# Altium schematic sheet PBC.SchDoc: =filename
size A4
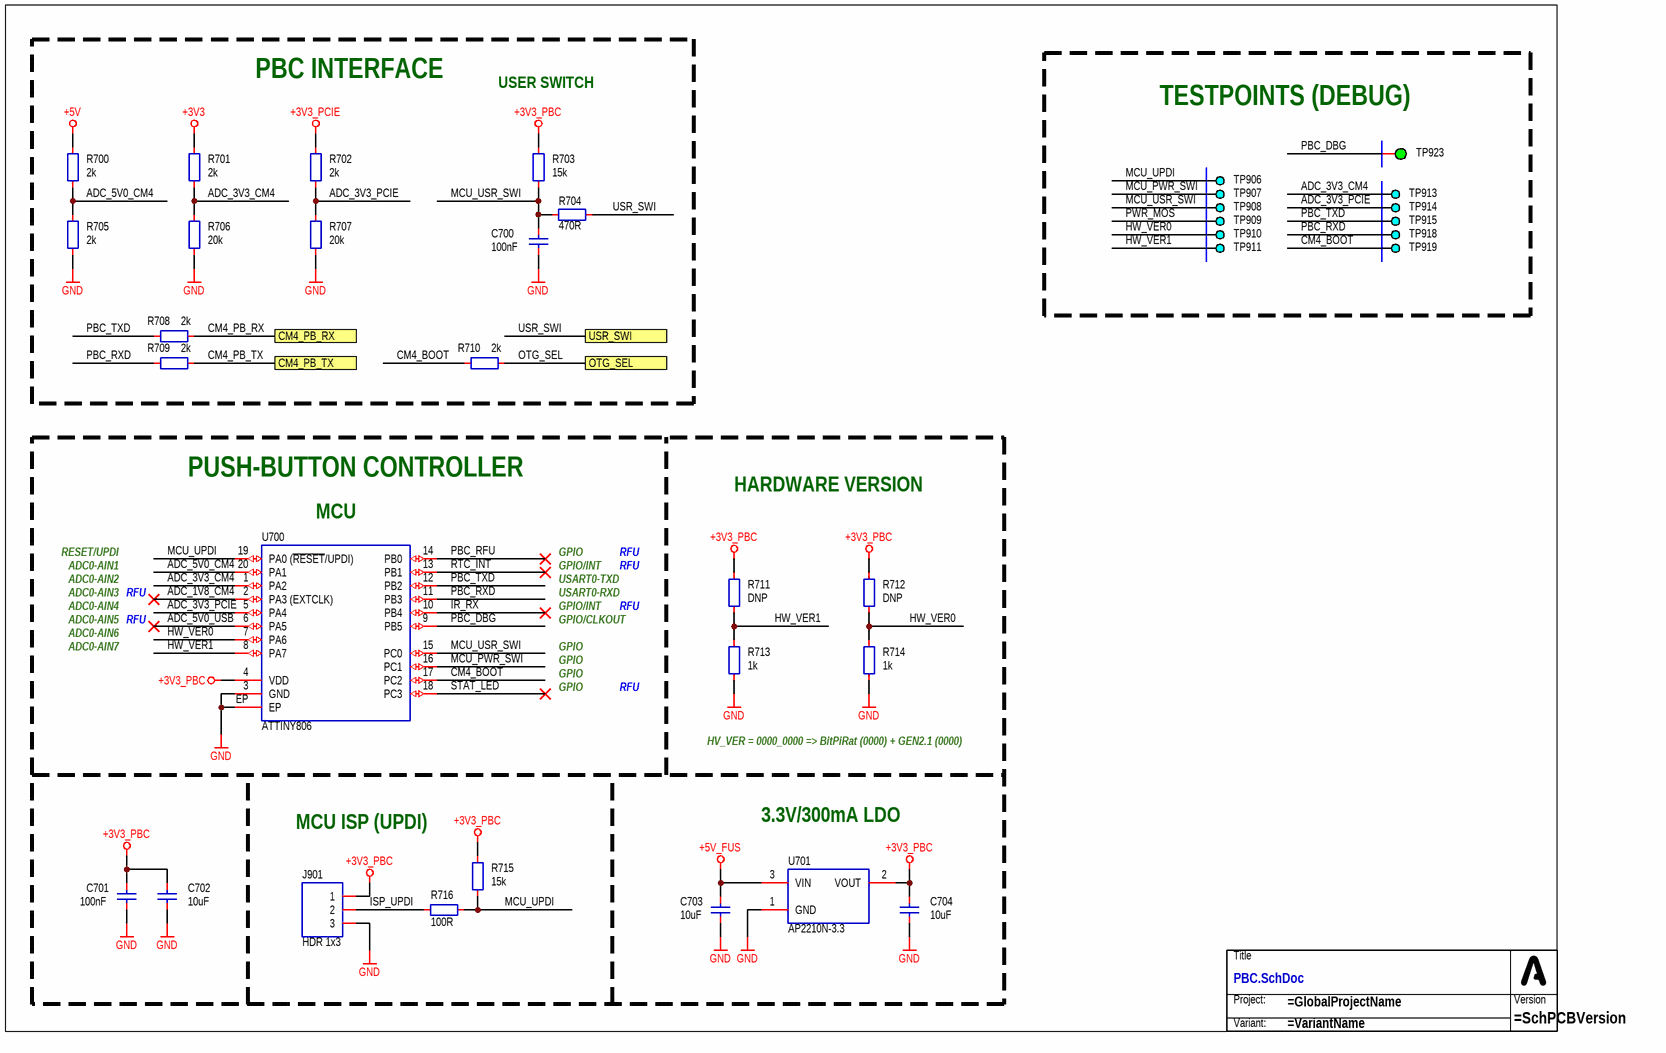
[diagram p0: PBC.SchDoc]

## Parts
C700  100nF  [CAP_0603_R]
C701  100nF  [CAP_0603_R]
C702  10uF  [CAP_0603_R]
C703  10uF  [CAP_0603_R]
C704  10uF  [CAP_0603_R]
J901  HDR 1x3  [CON_HDR_P254_1X03_STR]
R700  2k  [RES_0603_R]
R701  2k  [RES_0603_R]
R702  2k  [RES_0603_R]
R703  15k  [RES_0603_R]
R704  470R  [RES_0603_R]
R705  2k  [RES_0603_R]
R706  20k  [RES_0603_R]
R707  20k  [RES_0603_R]
R708  2k  [RES_0603_R]
R709  2k  [RES_0603_R]
R710  2k  [RES_0603_R]
R711  DNP  [RES_0603_R]
R712  DNP  [RES_0603_R]
R713  1k  [RES_0603_R]
R714  1k  [RES_0603_R]
R715  15k  [RES_0603_R]
R716  100R  [RES_0603_R]
TB700  (no value)  (no BOM)
TP906  DEBUG  [PCB_TP_DBG_50]  (value not drawn)  (no BOM)
TP907  DEBUG  [PCB_TP_DBG_50]  (value not drawn)  (no BOM)
TP908  DEBUG  [PCB_TP_DBG_50]  (value not drawn)  (no BOM)
TP909  DEBUG  [PCB_TP_DBG_50]  (value not drawn)  (no BOM)
TP910  DEBUG  [PCB_TP_DBG_50]  (value not drawn)  (no BOM)
TP911  DEBUG  [PCB_TP_DBG_50]  (value not drawn)  (no BOM)
TP913  DEBUG  [PCB_TP_DBG_50]  (value not drawn)  (no BOM)
TP914  DEBUG  [PCB_TP_DBG_50]  (value not drawn)  (no BOM)
TP915  DEBUG  [PCB_TP_DBG_50]  (value not drawn)  (no BOM)
TP918  DEBUG  [PCB_TP_DBG_50]  (value not drawn)  (no BOM)
TP919  DEBUG  [PCB_TP_DBG_50]  (value not drawn)  (no BOM)
TP923  ICT  [PCB_TP_ICT_100]  (value not drawn)  (no BOM)
U700  ATTINY806  [ICC_QFN20_300X300X90_P40_EP_R]
U701  AP2210N-3.3  [PKG_SOT23-3L_SC59_P190_R]

## Ports
CM4_PB_RX, CM4_PB_TX, OTG_SEL, USR_SWI

## Nets
+3V3: R701.1
+3V3_PBC: C701.2 C702.2 C704.2 J901.1 R703.2 R711.2 R712.2 R715.2 U700.4(VDD) U701.2(VOUT)
+3V3_PCIE: R702.1
+5V: R700.1
+5V_FUS: C703.2 U701.3(VIN)
GND: C700.1 C701.1 C702.1 C703.1 C704.1 J901.3 R705.2 R706.1 R707.1 R713.1 R714.1 U700.3(GND) U700.EP U701.1(GND)
ADC_1V8_CM4: U700.2(PA3_(EXTCLK))
ADC_3V3_CM4: R701.2 R706.2 TP913.1 U700.1(PA2)
ADC_3V3_PCIE: R702.2 R707.2 TP914.1 U700.5(PA4)
ADC_5V0_CM4: R700.2 R705.1 U700.20(PA1)
ADC_5V0_USB: U700.6(PA5)
CM4_BOOT: R710.2 TP919.1 U700.17(PC2)
CM4_PB_RX: R708.2 ; port CM4_PB_RX
CM4_PB_TX: R709.2 ; port CM4_PB_TX
HW_VER0: R712.1 R714.2 TP910.1 U700.7(PA6)
HW_VER1: R711.1 R713.2 TP911.1 U700.8(PA7)
IR_RX: U700.10(PB4)
ISP_UPDI: J901.2 R716.1
MCU_PWR_SWI: TP907.1 U700.16(PC1)
MCU_UPDI: R715.1 R716.2 TP906.1 U700.19(PA0_(~{RESET}/UPDI))
MCU_USR_SWI: C700.2 R703.1 R704.2 TP908.1 U700.15(PC0)
OTG_SEL: R710.1 ; port OTG_SEL
PBC_DBG: TP923.1 U700.9(PB5)
PBC_RFU: U700.14(PB0)
PBC_RXD: R709.1 TP918.1 U700.11(PB3)
PBC_TXD: R708.1 TP915.1 U700.12(PB2)
PWR_MOS: TP909.1
RTC_INT: U700.13(PB1)
STAT_LED: U700.18(PC3)
USR_SWI: R704.1 ; port USR_SWI

## Notes on the sheet
- PBC INTERFACE
- USER SWITCH
- (near TP923) TESTPOINTS (DEBUG)
- PUSH-BUTTON CONTROLLER
- (near U700) MCU
- HARDWARE VERSION
- RESET/UPDI
- ADC0-AIN1
- ADC0-AIN2
- USART0-TXD
- GPIO/INT
- GPIO
- RFU
- ADC0-AIN3
- ADC0-AIN4
- ADC0-AIN5
- ADC0-AIN6
- ADC0-AIN7
- USART0-RXD
- GPIO/CLKOUT
- HV_VER = 0000_0000 => BitPiRat (0000) + GEN2.1 (0000)
- MCU ISP (UPDI)
- 3.3V/300mA LDO
- (in symbol SCH_TITLE_BLOCK_SIMPLE_NODATE) Title; Project:; Version; Variant:

## Library data of the parts
C700 C701 = CAP-0008: Capacitor; MLCC; 100nF; 10V X5R; Manufacturer: YAGEO; MPN: CC0603KRX7R9BB104; Package (Case): 0603; Component Type: Capacitor; Component Subtype: MLCC; Value: 100nF; Mounting Type: SMD
C702-C704 = CAP-0023: CAP SMD 10u/10V ±10% 10V X5R (0603); Manufacturer: Samsung Electro-Mechanics; MPN: CL10A106KP8NNNC; Component Subtype: MLCC; Package (Case): 0603; Component Type: Capacitor; Value: 10uF; Mounting Type: SMD
J901 = CON_1X03_COL: CONN THT / HEADER / PITCH 2,54mm / VERTICAL / (3 PIN); Manufacturer: Ckmtw(Shenzhen Cankemeng); MPN: B-2100S03P-A110; Component Subtype: Pin Header; Value: HDR 1x3; Component Type: Connector; Mounting Type: THT; Package (Case): THT
R700-R702 R705 R708-R710 = RES-0033: Resistor; Thick Film; 2k2; 1%; 100mW; 100PPM; 75V; Standard; SMD; 0603 (1608);; Manufacturer: UNI-ROYAL(Uniroyal Elec); MPN: 0603WAF2001T5E; Package (Case): 0603; Component Type: Resistor; Component Subtype: Thick Film; Value: 2k; Mounting Type: SMD
R703 R715 = RES-0043: Resistor; Thick Film; 15k; 1%; 100mW; 100PPM; 75V; Standard; SMD; 0603 (1608);; Manufacturer: UNI-ROYAL(Uniroyal Elec); MPN: 0603WAF1502T5E; Package (Case): 0603; Component Type: Resistor; Component Subtype: Thick Film; Value: 15k; Mounting Type: SMD
R704 = RES-0042: Resistor; Thick Film; 470R; 1%; 100mW; 100PPM; 75V; Standard; SMD; 0603 (1608);; Manufacturer: UNI-ROYAL(Uniroyal Elec); MPN: 0603WAF4700T5E; Package (Case): 0603; Component Type: Resistor; Component Subtype: Thick Film; Value: 470R; Mounting Type: SMD
R706 R707 = RES-0054: Resistor; Thick Film; 20k; SMD; 0603 (1608);; Manufacturer: UNI-ROYAL(Uniroyal Elec); MPN: 0603WAF2002T5E; Package (Case): 0603; Component Type: Resistor; Component Subtype: Thick Film; Value: 20k; Mounting Type: SMD
R711 R712 = RES-0051: Component Subtype: Thick Film; Package (Case): 0603; Component Type: Resistor; Value: DNP; Mounting Type: SMD
R713 R714 = RES-0027: Resistor; Thick Film; 1k; 1%; 100mW; 100PPM; 75V; Standard; SMD; 0603 (1608);; Manufacturer: UNI-ROYAL(Uniroyal Elec); MPN: 0603WAF1001T5E; Package (Case): 0603; Component Type: Resistor; Component Subtype: Thick Film; Value: 1k; Mounting Type: SMD
R716 = RES-0026: Resistor; Thick Film; 100R; 1%; 100mW; 100PPM; 75V; Standard; SMD; 0603 (1608);; Manufacturer: UNI-ROYAL(Uniroyal Elec); MPN: 0603WAF1000T5E; Package (Case): 0603; Component Type: Resistor; Component Subtype: Thick Film; Value: 100R; Mounting Type: SMD
TB700 = SCH_TITLE_BLOCK_SIMPLE_NODATE
TP906-TP911 TP913-TP915 TP918 TP919 = PCB_TP_DBG: PCB Marking; Test Point (Debug);; Value: DEBUG; Component Type: Testpoint
TP923 = PCB_TP_ICT: Test Point (ICT); Component Type: Testpoint (for ICT); Mounting Type: Non component; Value: ICT
U700 = ICC_MCP_ATTINY406_806_1606_VQFN20: IC; MCU; tinyAVR 8-bit MCU, 20MHz, 8kB flash, 512B RAM, USART, SPI, TWI, VQFN package; Manufacturer: Microchip Technology (Atmel); MPN: ATTINY806-MNR; Package (Case): VQFN20; Component Type: IC; Mounting Type: SMD; Value: ATTINY806
U701 = ICC_DIO_AP2210N-3.3TR: ICC; LDO regulator; AP2210N-3.3, Ultra-low dropout voltage regulator, Vout = 3.3V, 300 mA, SOT23-3 package; Manufacturer: Diodes Incorporated; MPN: AP2210N-3.3TRG1; Component Type: IC; Mounting Type: SMD; Value: AP2210N-3.3; Package (Case): SOT23-3